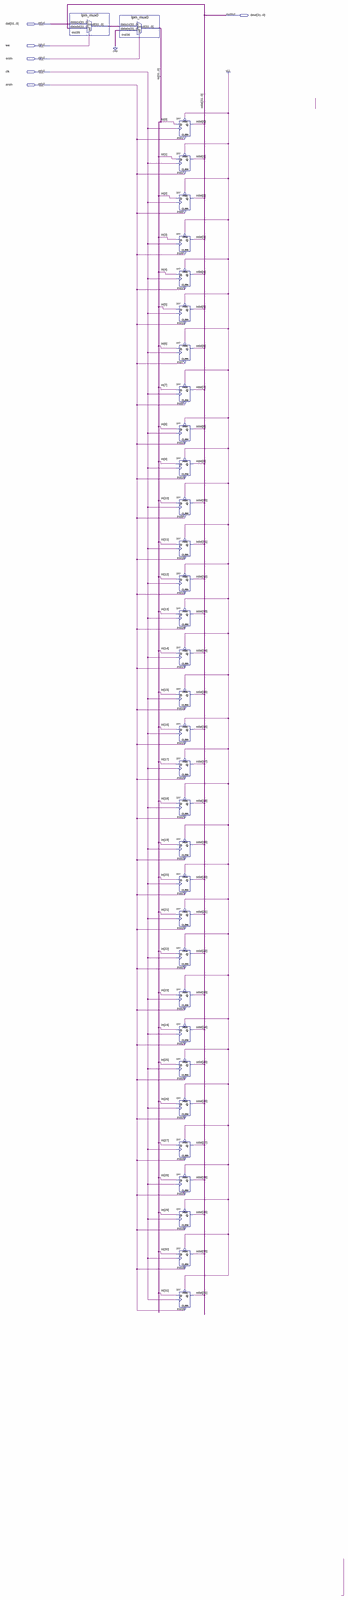
[diagram p0: schematic sheet, whole]
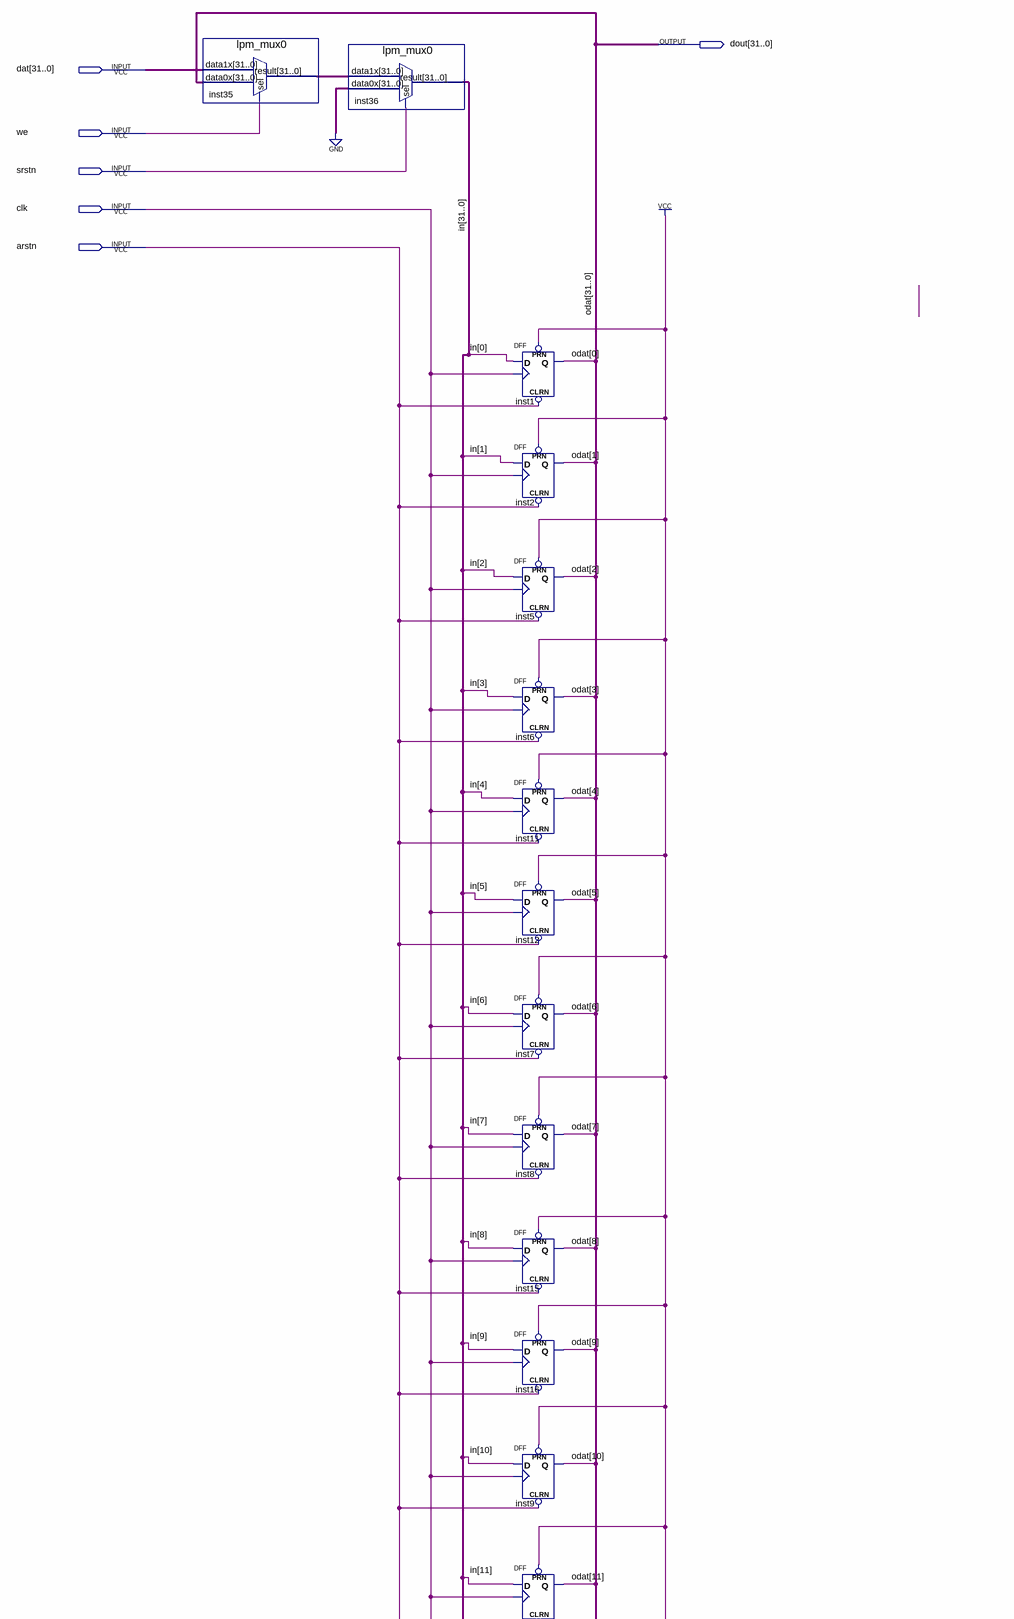
[diagram p1: schematic sheet, upper part]
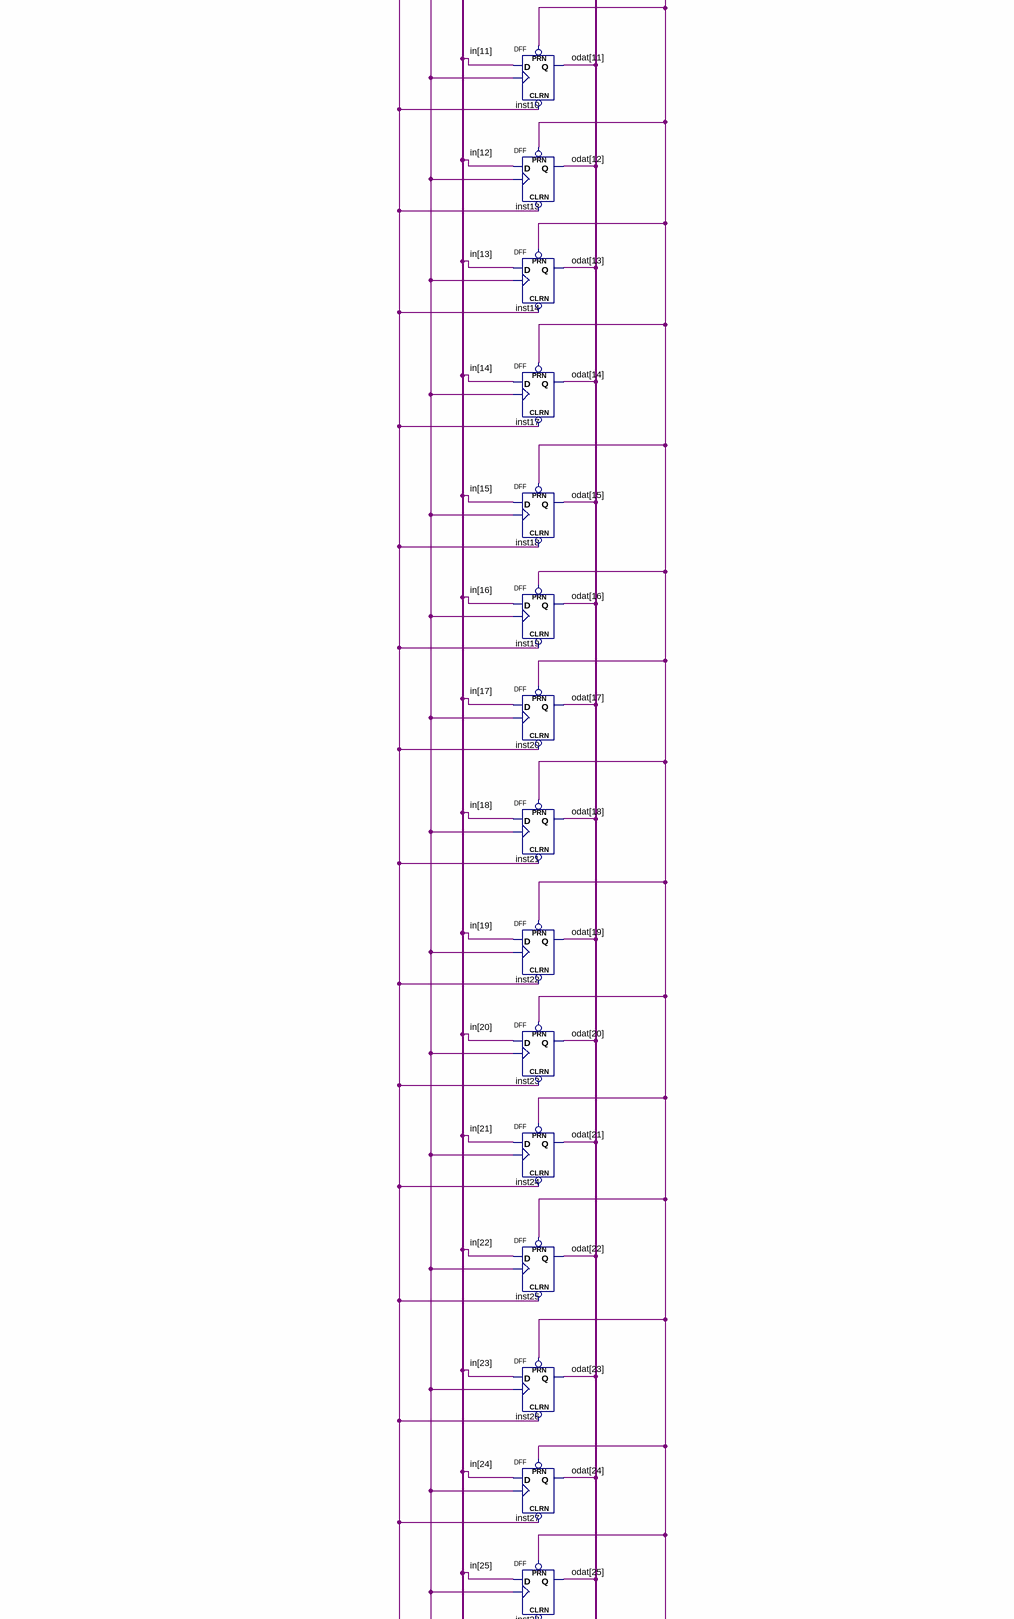
[diagram p2: schematic sheet, middle part]
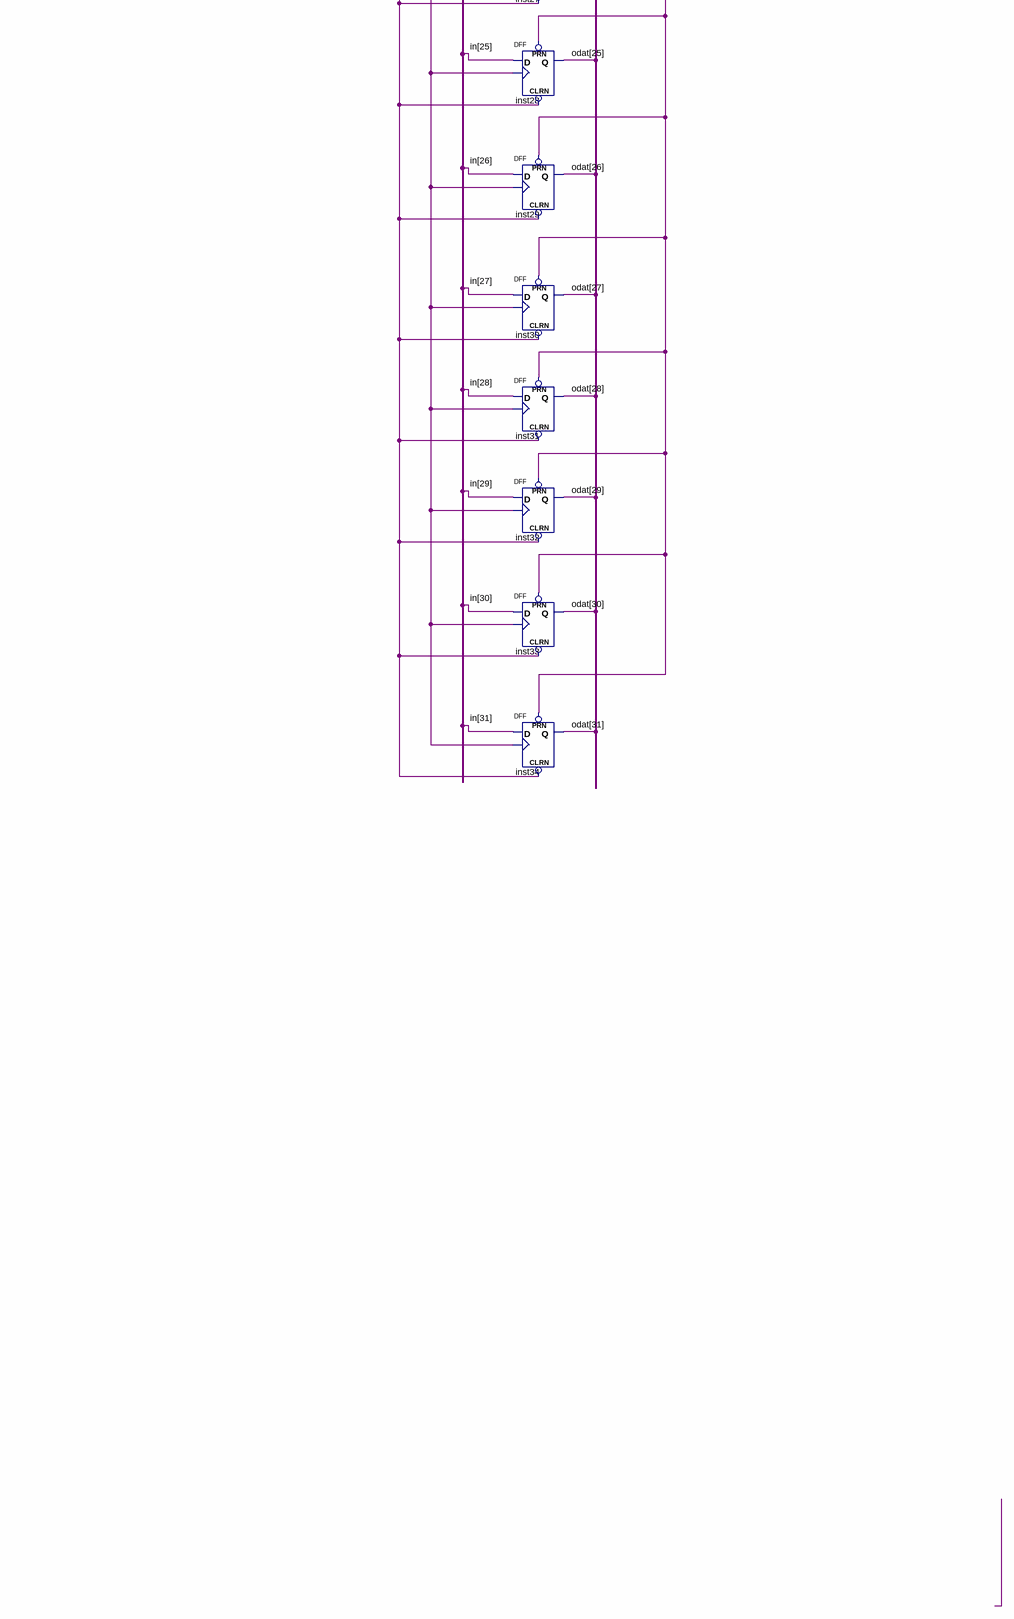
[diagram p3: schematic sheet, lower part]
// Quartus schematic LAB1.bdf as structural Verilog: 34 symbols, 6 pins
module LAB1 (
  input  [31:0] dat,
  input  we,
  input  srstn,
  input  clk,
  input  arstn,
  output [31:0] dout
);

  wire [31:0] in, inst35_result;

  lpm_mux0 inst35 (.data1x(dat), .data0x(dout), .sel(we), .result(inst35_result));
  lpm_mux0 inst36 (.data1x(inst35_result), .data0x({32{1'b0}}), .sel(srstn), .result(in));
  DFF inst1 (.CLRN(arstn), .CLK(clk), .D(in[0]), .PRN(1'b1), .Q(dout[0]));
  DFF inst2 (.CLRN(arstn), .CLK(clk), .D(in[1]), .PRN(1'b1), .Q(dout[1]));
  DFF inst5 (.CLRN(arstn), .CLK(clk), .D(in[2]), .PRN(1'b1), .Q(dout[2]));
  DFF inst6 (.CLRN(arstn), .CLK(clk), .D(in[3]), .PRN(1'b1), .Q(dout[3]));
  DFF inst11 (.CLRN(arstn), .CLK(clk), .D(in[4]), .PRN(1'b1), .Q(dout[4]));
  DFF inst12 (.CLRN(arstn), .CLK(clk), .D(in[5]), .PRN(1'b1), .Q(dout[5]));
  DFF inst7 (.CLRN(arstn), .CLK(clk), .D(in[6]), .PRN(1'b1), .Q(dout[6]));
  DFF inst8 (.CLRN(arstn), .CLK(clk), .D(in[7]), .PRN(1'b1), .Q(dout[7]));
  DFF inst15 (.CLRN(arstn), .CLK(clk), .D(in[8]), .PRN(1'b1), .Q(dout[8]));
  DFF inst16 (.CLRN(arstn), .CLK(clk), .D(in[9]), .PRN(1'b1), .Q(dout[9]));
  DFF inst9 (.CLRN(arstn), .CLK(clk), .D(in[10]), .PRN(1'b1), .Q(dout[10]));
  DFF inst10 (.CLRN(arstn), .CLK(clk), .D(in[11]), .PRN(1'b1), .Q(dout[11]));
  DFF inst13 (.CLRN(arstn), .CLK(clk), .D(in[12]), .PRN(1'b1), .Q(dout[12]));
  DFF inst14 (.CLRN(arstn), .CLK(clk), .D(in[13]), .PRN(1'b1), .Q(dout[13]));
  DFF inst17 (.CLRN(arstn), .CLK(clk), .D(in[14]), .PRN(1'b1), .Q(dout[14]));
  DFF inst18 (.CLRN(arstn), .CLK(clk), .D(in[15]), .PRN(1'b1), .Q(dout[15]));
  DFF inst19 (.CLRN(arstn), .CLK(clk), .D(in[16]), .PRN(1'b1), .Q(dout[16]));
  DFF inst20 (.CLRN(arstn), .CLK(clk), .D(in[17]), .PRN(1'b1), .Q(dout[17]));
  DFF inst21 (.CLRN(arstn), .CLK(clk), .D(in[18]), .PRN(1'b1), .Q(dout[18]));
  DFF inst22 (.CLRN(arstn), .CLK(clk), .D(in[19]), .PRN(1'b1), .Q(dout[19]));
  DFF inst23 (.CLRN(arstn), .CLK(clk), .D(in[20]), .PRN(1'b1), .Q(dout[20]));
  DFF inst24 (.CLRN(arstn), .CLK(clk), .D(in[21]), .PRN(1'b1), .Q(dout[21]));
  DFF inst25 (.CLRN(arstn), .CLK(clk), .D(in[22]), .PRN(1'b1), .Q(dout[22]));
  DFF inst26 (.CLRN(arstn), .CLK(clk), .D(in[23]), .PRN(1'b1), .Q(dout[23]));
  DFF inst27 (.CLRN(arstn), .CLK(clk), .D(in[24]), .PRN(1'b1), .Q(dout[24]));
  DFF inst28 (.CLRN(arstn), .CLK(clk), .D(in[25]), .PRN(1'b1), .Q(dout[25]));
  DFF inst29 (.CLRN(arstn), .CLK(clk), .D(in[26]), .PRN(1'b1), .Q(dout[26]));
  DFF inst30 (.CLRN(arstn), .CLK(clk), .D(in[27]), .PRN(1'b1), .Q(dout[27]));
  DFF inst31 (.CLRN(arstn), .CLK(clk), .D(in[28]), .PRN(1'b1), .Q(dout[28]));
  DFF inst32 (.CLRN(arstn), .CLK(clk), .D(in[29]), .PRN(1'b1), .Q(dout[29]));
  DFF inst33 (.CLRN(arstn), .CLK(clk), .D(in[30]), .PRN(1'b1), .Q(dout[30]));
  DFF inst34 (.CLRN(arstn), .CLK(clk), .D(in[31]), .PRN(1'b1), .Q(dout[31]));

  // Other names for the same wires on the sheet: odat[31:0] = dout
endmodule
